# EAGLE design Lagopus_A_3 (EAGLE 9.6.2)
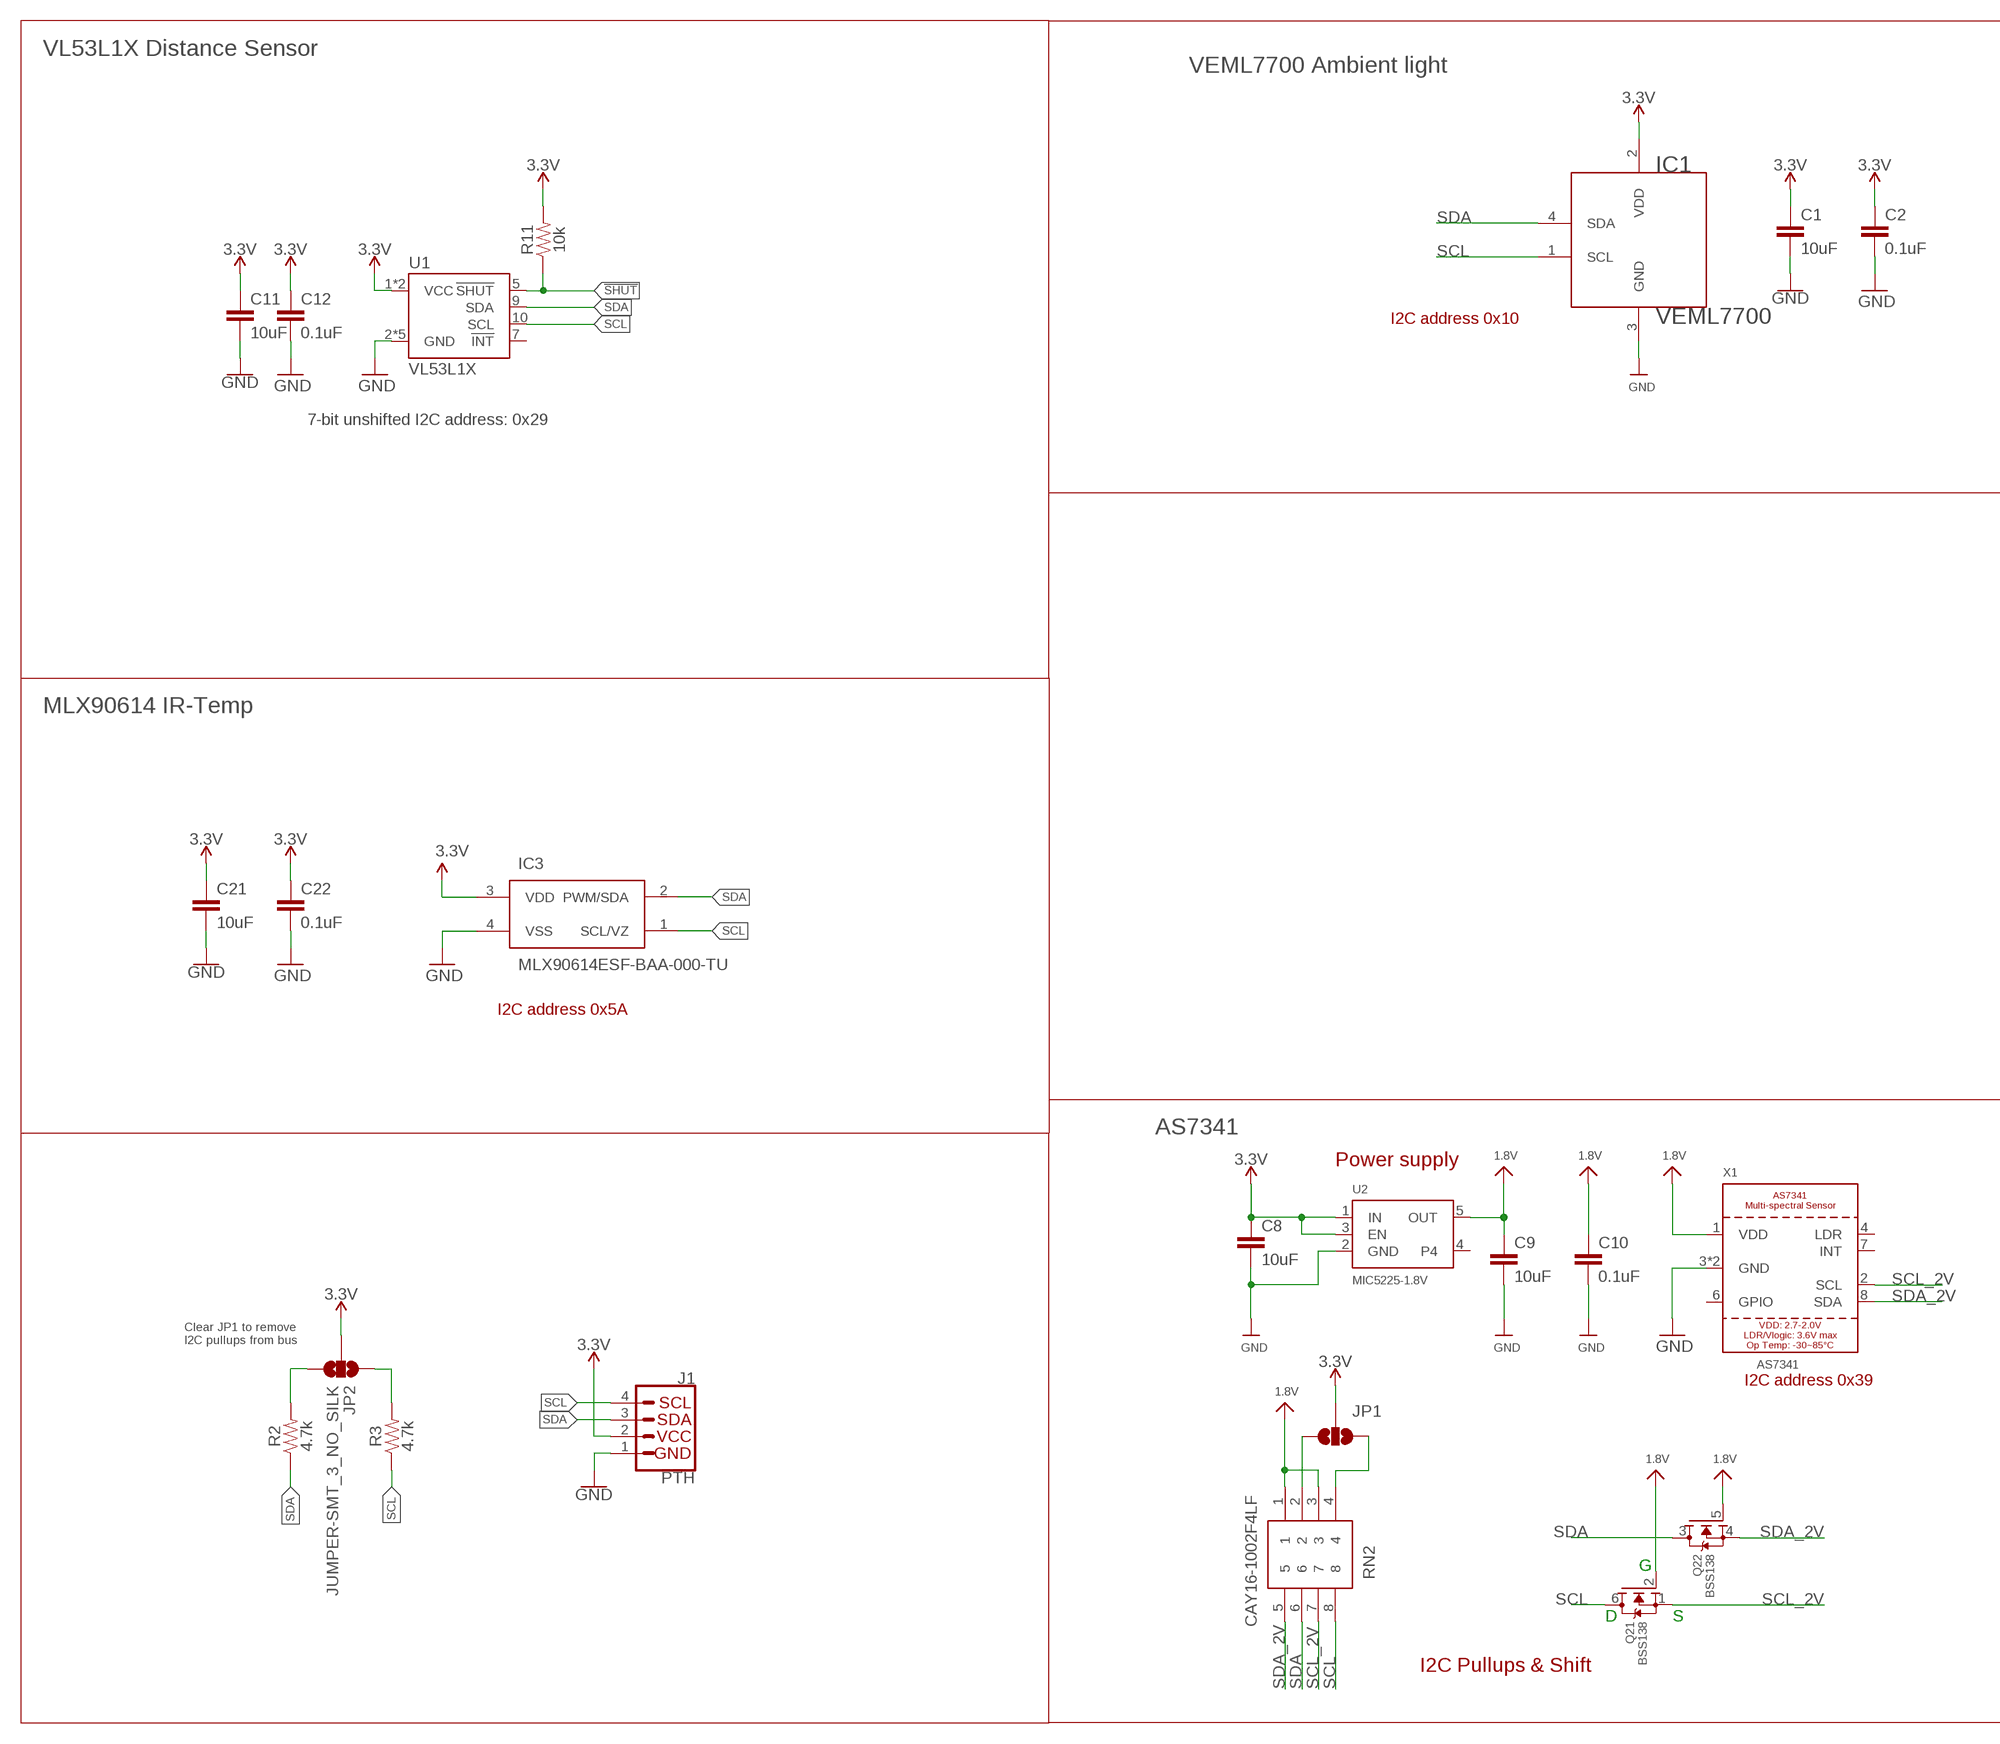
[diagram p0: schematic, sheet 1, part 1 of 2]
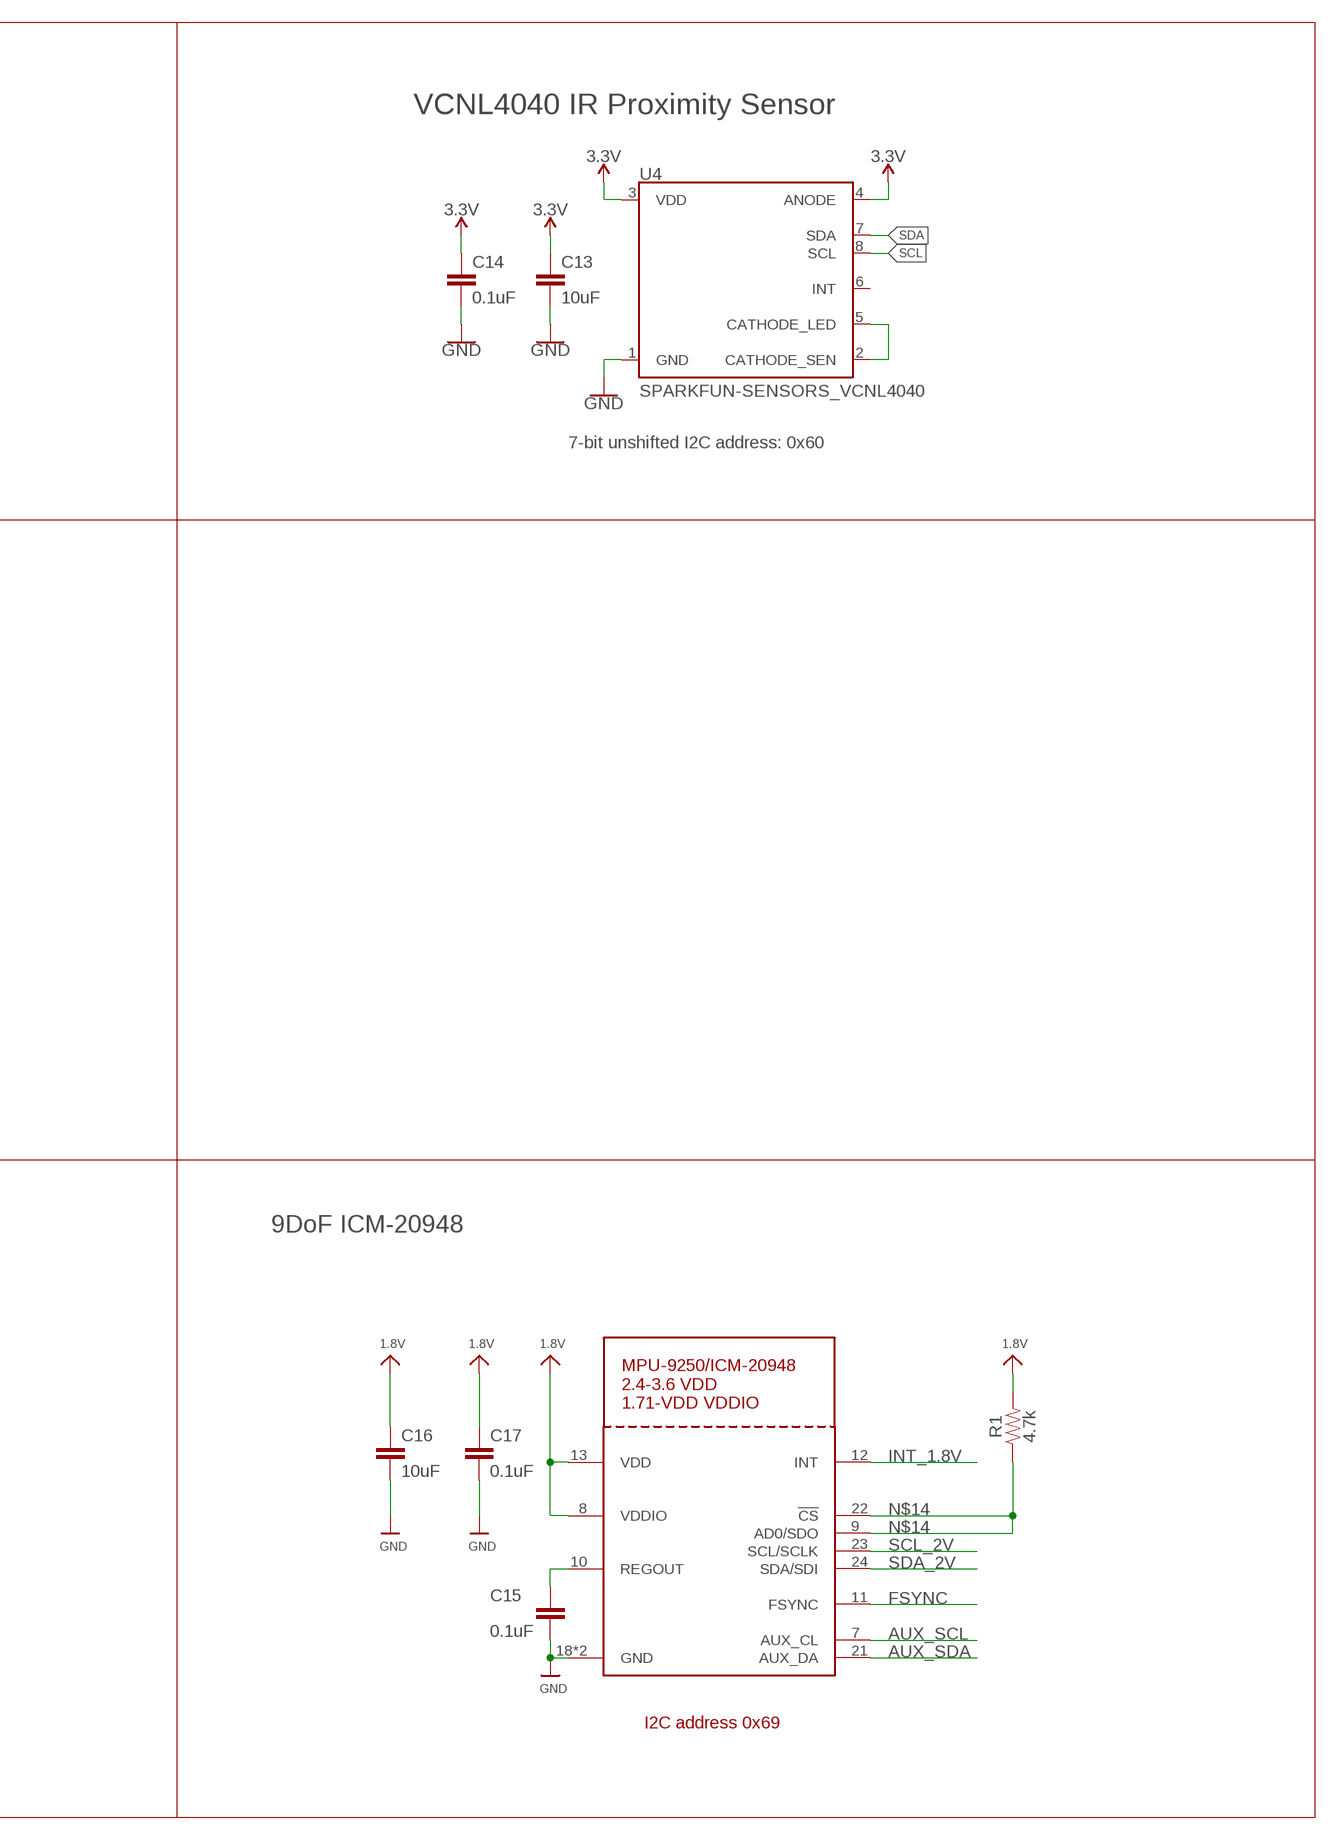
[diagram p1: schematic, sheet 1, part 2 of 2]

## Parts
C1  10uF  10UF-0603-6.3V-20%  [0603]
C2  0.1uF  0.1UF-0603-25V-(+80/-20%)  [0603]
C8  10uF  10UF-0603-6.3V-20%  [0603]
C9  10uF  10UF-0603-6.3V-20%  [0603]
C10  0.1uF  0.1UF-0603-25V-(+80/-20%)  [0603]
C11  10uF  10UF-0603-6.3V-20%  [0603]
C12  0.1uF  0.1UF-0603-25V-(+80/-20%)  [0603]
C13  10uF  10UF-0603-6.3V-20%  [0603]
C14  0.1uF  0.1UF-0603-25V-(+80/-20%)  [0603]
C15  0.1uF  0.1UF-0603-25V-(+80/-20%)  [0603]
C16  10uF  10UF-0603-6.3V-20%  [0603]
C17  0.1uF  0.1UF-0603-25V-(+80/-20%)  [0603]
C21  10uF  10UF-0603-6.3V-20%  [0603]
C22  0.1uF  0.1UF-0603-25V-(+80/-20%)  [0603]
IC1  VEML7700  [VEML7700]
IC3  MLX90614ESF-BAA-000-TU  [MLX90614ESFBAA000TU]
J1  PTH  I2C_STANDARD_NO_SILK  [1X04_NO_SILK]
JP1  JUMPER-SMT_3_NO_SILK  [SMT-JUMPER_3_NO_SILK]
JP2  JUMPER-SMT_3_NO_SILK  [SMT-JUMPER_3_NO_SILK]
Q2  BSS138  MOSFET-N_DUAL  [SOT363]
R1  4.7k  4.7KOHM-0603-1/10W-1%  [0603]
R2  4.7k  4.7KOHM-0603-1/10W-1%  [0603]
R3  4.7k  4.7KOHM-0603-1/10W-1%  [0603]
R11  10k  10KOHM-0603-1/10W-1%  [0603]
RN2  CAY16-1002F4LF  [CAY-16-F4]
U1  VL53L1X  VL53L1XSMD  [VL53L1X]
U2  MIC5225-1.8V  VREG_SOT23-5  [SOT23-5]
U4  SPARKFUN-SENSORS_VCNL4040  [SPARKFUN-SENSORS_SPARKX_VCNL4040]
U$21  MPU-9250_ICM20948  [QFN24_3MM_NOEP]
X1  AS7341  [AS7341]

## Nets
1.8V: C9.1 C10.1 C16.1 C17.1 Q2.2(1:G) Q2.5(2:G) R1.2 RN2.1 RN2.3 U2.5(OUT) U$21.8(VDDIO) U$21.13(VDD) X1.1(VDD)
3.3V: C1.1 C2.1 C8.1 C11.1 C12.1 C13.1 C14.1 C21.1 C22.1 IC1.2(VDD) IC3.3(VDD) J1.2(VCC) JP1.2 JP2.2 R11.2 U1.1(VCC) U1.11(VCC) U2.1(IN) U2.3(EN) U4.3(VDD) U4.4(ANODE)
!SHUT: R11.1 U1.5(!SHUT)
AUX_SCL: U$21.7(AUX_CL)
AUX_SDA: U$21.21(AUX_DA)
FSYNC: U$21.11(FSYNC)
GND: C1.2 C2.2 C8.2 C9.2 C10.2 C11.2 C12.2 C13.2 C14.2 C15.2 C16.2 C17.2 C21.2 C22.2 IC1.3(GND) IC3.4(VSS) J1.1(GND) U1.2(GND) U1.3(GND) U1.4(GND) U1.6(GND) U1.12(GND) U2.2(GND) U4.1(GND) U$21.18(GND) U$21.20(GND) X1.3(GND) X1.5(GND)
INT_1.8V: U$21.12(INT)
N$1: JP1.1 RN2.2
N$2: JP1.3 RN2.4
N$7: JP2.3 R2.2
N$8: JP2.1 R3.2
N$12: U4.2(CATHODE_SEN) U4.5(CATHODE_LED)
N$13: C15.1 U$21.10(REGOUT)
N$14: R1.1 U$21.9(AD0/SDO) U$21.22(!CS)
SCL: IC1.1(SCL) IC3.1(SCL/VZ) J1.4(SCL) Q2.6(1:D) R3.1 RN2.8 U1.10(SCL) U4.8(SCL)
SCL_2V: Q2.1(1:S) RN2.7 U$21.23(SCL/SCLK) X1.2(SCL)
SDA: IC1.4(SDA) IC3.2(PWM/SDA) J1.3(SDA) Q2.3(2:D) R2.1 RN2.6 U1.9(SDA) U4.7(SDA)
SDA_2V: Q2.4(2:S) RN2.5 U$21.24(SDA/SDI) X1.8(SDA)
Unconnected: U1.7(!INT) U2.4 U4.6(INT) X1.4(LDR) X1.7(INT)

## Notes on the sheet
- VL53L1X Distance Sensor
- VEML7700 Ambient light
- VCNL4040 IR Proximity Sensor
- I2C address 0x10
- 7-bit unshifted I2C address: 0x29 | 7-bit unshifted I2C address: 0x60
- MLX90614 IR-Temp
- I2C address 0x5A
- AS7341
- Power supply | 9DoF ICM-20948
- Clear JP1 to remove
  I2C pullups from bus
- I2C address 0x39
- G
- D | S
- I2C address 0x69
- I2C Pullups & Shift

## Power pins joined to a net without a drawn wire
GPIO: X1.6(GPIO)

## Library data of the parts
C1 C8 C9 C11 C13 C16 C21 = SparkFun-Capacitors:10UF: 10.0µF ceramic capacitors A capacitor is a passive two-terminal electrical component used to store electrical energy temporarily in an electric field.; PROD_ID: CAP-11015
C2 C10 C12 C14 C15 C17 C22 = SparkFun-Capacitors:0.1UF: 0.1µF ceramic capacitors A capacitor is a passive two-terminal electrical component used to store electrical energy temporarily in an electric field.; PROD_ID: CAP-00810
IC1 = VEML7700:VEML7700
IC3 = MLX90614ESF-BAA-000-TU:MLX90614ESF-BAA-000-TU: Board Mount Temperature Sensors Digital, plug & play, infrared thermometer in a TO-can Source: Datasheet <http://uk.rs-online.com/web/p/products/1942939>; DESCRIPTION: Board Mount Temperature Sensors Digital, plug & play, infrared thermometer in a TO-can; HEIGHT: 4.25mm; MANUFACTURER_NAME: Melexis; MANUFACTURER_PART_NUMBER: MLX90614ESF-BAA-000-TU; RS_PART_NUMBER: 1942939; RS_PRICE-STOCK: http://uk.rs-online.com/web/p/products/1942939
J1 = SparkX:I2C_STANDARD: SparkFun I2C Standard Pinout Header SparkFun has standardized on a pinout for all I2C based sensor breakouts. This pinout allows I2C boards to be plugged directly into the headers on Arduino Uno compatible boards, and to be daisy chained easily. Example SparkFun Products: SparkFun Atmospheric Sensor Breakout - BME280 <https://www.sparkfun.com/products/13676> SparkFun Altitude/Pressure Sensor Breakout - MPL3115A2 <https://www.sparkfun.com/products/11084> SparkFun TOF Range Finder Sensor - VL6180 <https://www.sparkfun.com/products/12785>
JP1 JP2 = SparkFun-Jumpers:JUMPER-SMT_3_NO: Normally open jumper This jumper has three pads in close proximity to each other. Apply solder to close the connection(s).
Q2 = microbuilder:MOSFET-N_DUAL: Dual N-Channel MOSFET SOT363 (2.0x1.25mm) 2N7002PS - 60V, 320mA [Digikey: 568-5984-1-ND]
R1-R3 = SparkFun-Resistors:4.7KOHM: 4.7kΩ resistor A resistor is a passive two-terminal electrical component that implements electrical resistance as a circuit element. Resistors act to reduce current flow, and, at the same time, act to lower voltage levels within circuits. - Wikipedia; PROD_ID: RES-07857
R11 = SparkFun-Resistors:10KOHM: 10kΩ resistor A resistor is a passive two-terminal electrical component that implements electrical resistance as a circuit element. Resistors act to reduce current flow, and, at the same time, act to lower voltage levels within circuits. - Wikipedia; PROD_ID: RES-00824
RN2 = CAY16-1002F4LF:CAY16-1002F4LF: Resistor Arrays 10K 1% Convex 4 resist. Bourns CAY16 Series 10k +/-1% Isolated SMT Resistor Array, 4 Resistors, 0.25W total 1206 Package Convex Source: Datasheet <http://uk.rs-online.com/web/p/products/7408767P>; ALLIED_NUMBER: 70276325; DESCRIPTION: Resistor Arrays 10K 1% Convex 4 resist. Bourns CAY16 Series 10k +/-1% Isolated SMT Resistor Array, 4 Resistors, 0.25W total 1206 Package Convex; HEIGHT: mm; MANUFACTURER_NAME: Bourns; MANUFACTURER_PART_NUMBER: CAY16-1002F4LF; RS_PART_NUMBER: 7408767P; RS_PRICE-STOCK: http://uk.rs-online.com/web/p/products/7408767P
U1 = SparkFun-Sensors:VL53L1X: STMicroelectronics VL53L1X - 400 cm IR Laser ToF Sensor VL53L1X is a state-of-the-art ToF laser-ranging sensor, enhancing the ST FlightSense product family. It is the fastest miniature ToF sensor currently on the market with accurate ranging up to 4 m and fast ranging frequency (up to 50 Hz). Housed in a miniature and reflowable package, it integrates a single photon avalanche diode (SPAD) receiving array, a 940 nm invisible laser Class 1 emitter, physical infrared filters, and optics to achieve the best ranging performance in various ambient lighting conditions with a range of cover window options.; PROD_ID: IC-13960
U2 = microbuilder:VREG_SOT23-5: SOT23-5 Fixed Voltage Regulators Part Current Out V Out V In V Dropout θJA (°C/W) TJ (°C) Digikey Part No. ADP121 150mA 3.3V 3.4-5.5V 0.09V @ 150mA -- -- ADP121-AUJZ33R7CT-ND ADP121 150mA 3.0V 3.1-5.5V 0.09V @ 150mA -- -- ADP121-AUJZ30R7CT-ND ADP122 300mA 3.3V 3.4-5.5V 0.085V @ 300mA -- -- ADP122AUJZ-3.3-R7CT-ND ADP1712 300mA 3.3V 3.5-5.5V 0.17V @ 300mA -- -- ADP1712AUJZ-3.3-R7TR-ND AP7311 (Low Cost) 150mA 3.3V 3.5-6V 0.15V @ 150mA -- -- AP7311-33WG-7DICT-ND LD39015M18R 150mA 1.8V 1.9V-5.5V 0.08V @ 100mA -- -- 497-6977-1-ND LP2985A-33DBVR 150mA 3.3V 3.3-16V 0.28V @ 150mA 206 150 296-18479-1-ND MCP1824T-3302E/OT 300mA 3.3V 3.5V-6V 0.2V @ 300mA -- -- MCP1824T-3302E/OTCT-ND MIC5205-2.5YM5 TR 150mA 2.5V 2.7-16V 0.165V @ 150mA -- -- 576-1257-2-ND MIC5205-3.0YM5 TR 150mA 3.0V 3.2V-16V 0.165V @ 150mA -- -- 576-1258-2-ND MIC5205-3.3YM5 TR 150mA 3.3V 3.5V-16V 0.165V @ 150mA -- -- 576-1259-2-ND TPS780330220 150mA 3.3V+2.2V 3.6-5.5V 250mV Max -- -- 296-23332-1-ND TDA3663/N1,135 100mA 3.3V 3.5-45V 0.18V @ 50mA -- -- 568-5343-1-ND Max operating temp can be calculated using θJA, TJ (max junction temperature), and power in watts. Set the "Maximum Ambient Temperature" until it reaches TJ ("Max Junction Temperature"), which is the absolute limit for safe use of the regulator: Heat Sink Temperature Calculator <http://www.daycounter.com/Calculators/Heat-Sink-Temperature-Calculator.phtml> For example, With 12V source into a 3.3V LP2985 and a 30mA load, we are dissipating (12V-3.3V) * 0.03A = 0.261W. With a θJA of 206 °C/W, a TJ of 150°C, and 261mW we can safely use the chip without a heat sink up to 75°C (=147.1°C Junction Temperature).
U4 = Lagopus_A_3:SPARKFUN-SENSORS_VCNL4040: Vishay VCNL4040 Human Presence sensor A presence sensor with a range of 20 cm. VCNL4040 integrates a proximity sensor (PS), ambient light sensor (ALS), and a high power IRED into one small package.; PROD_ID: IC-14227
U$21 = adafruit_sensor:MPU-9250: MPU-9250 3-Axis gyroscope and 3-Axis accelerometer
X1 = adafruit_sensor:AS7341

## Net classes
1 highpower: width 0.305 mm, drill 0.483 mm
2 lowpower: width 0.254 mm, drill 0.483 mm

## Board
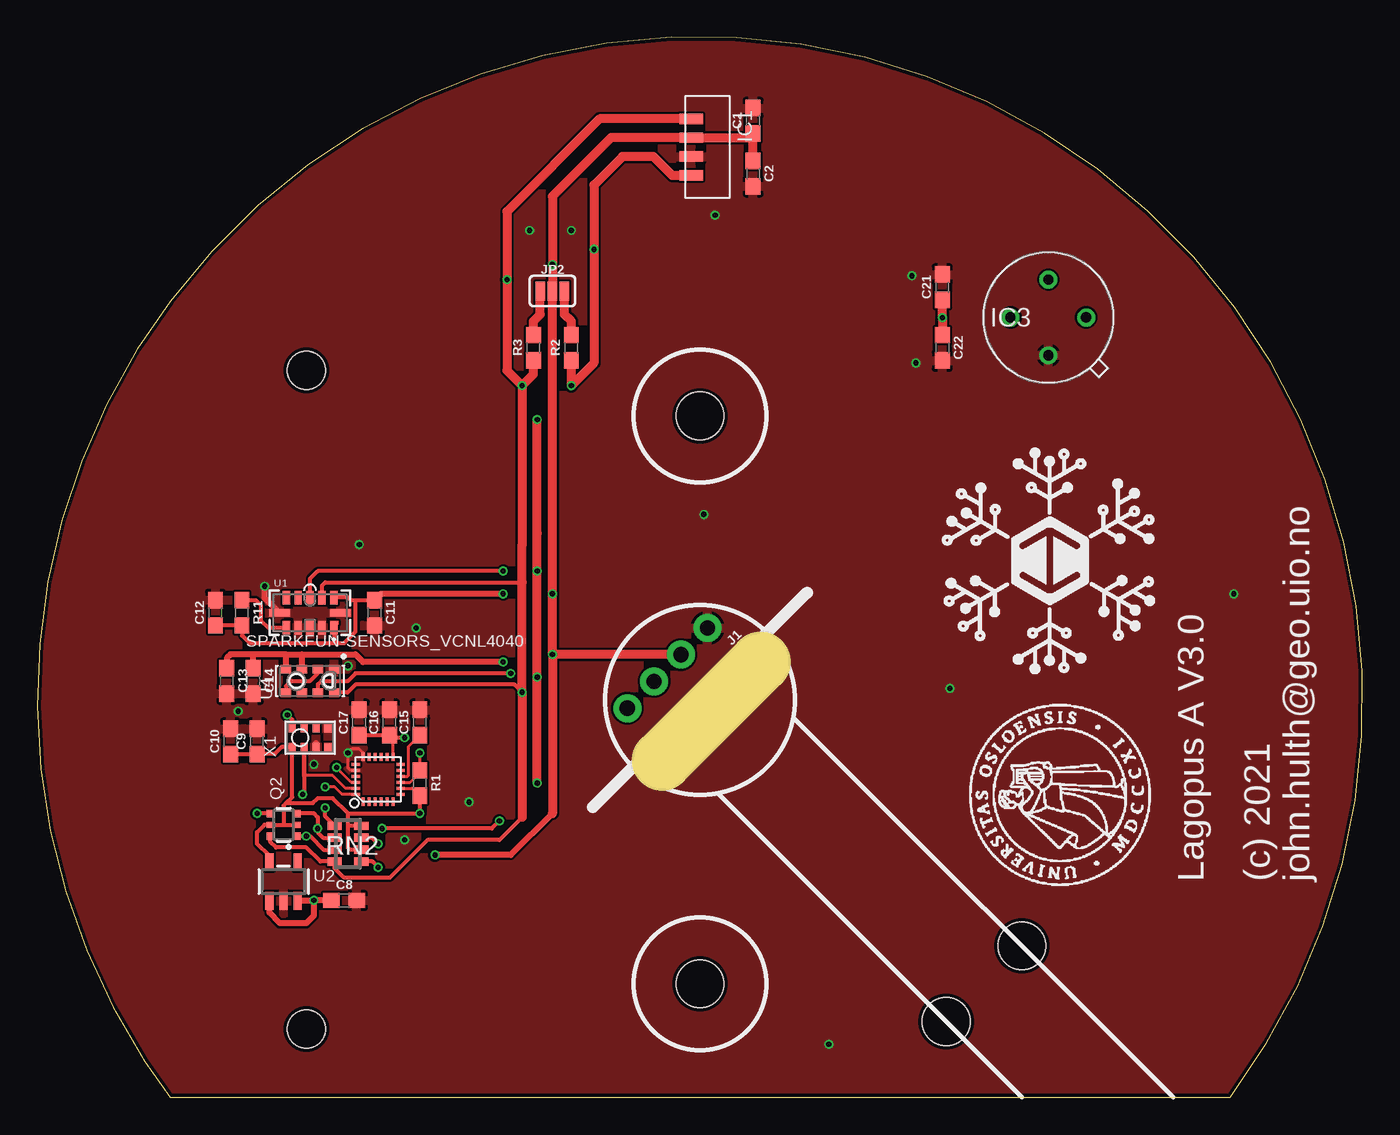
[diagram p2: board, top side]
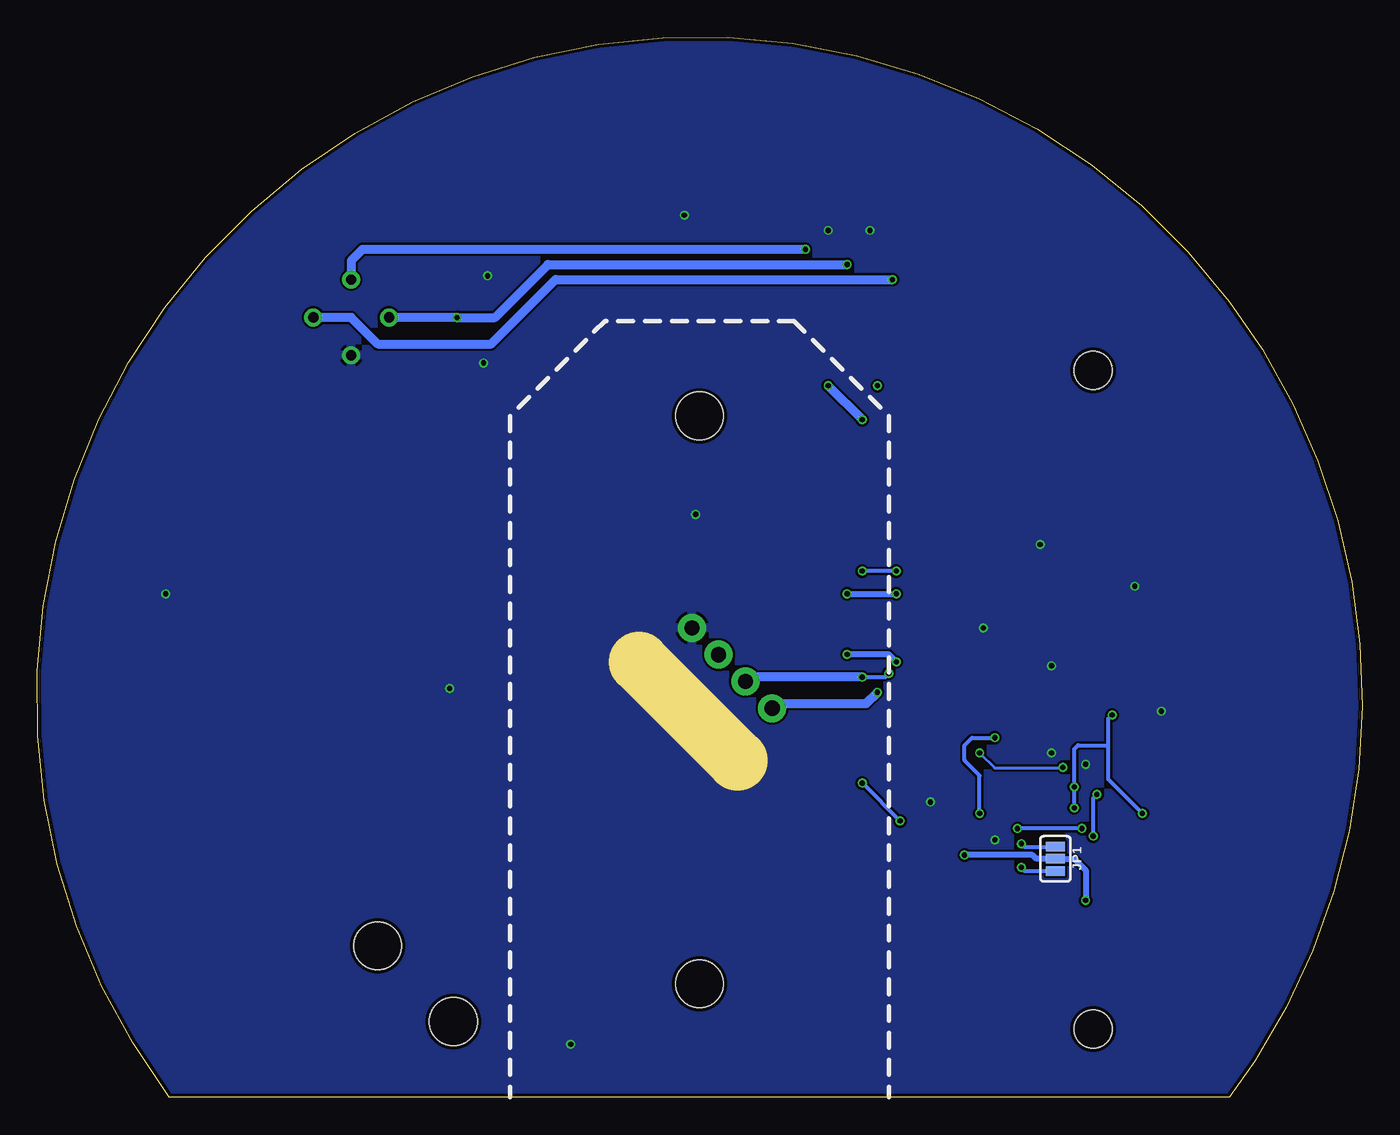
[diagram p3: board, bottom side, seen from below]

Size 88.89 x 71.13 mm. Coordinates in mm from the lower left corner, seen from the top.
Outline: 7.21,2.42 8.91,0 80.03,0 arc180 8.91,53.4 6.71,50.2 arc65 7.21,2.42
Copper layers (1*16): Top 0.018mm / dielectric 1.55mm / Bottom 0.018mm
Design rules "eC_2Layer_PClass6_BaseCopperO18_eCDefault": minimum track width 0.15mm, minimum drill 0.35mm, track to track 0.15mm, track to pad 0.15mm, pad to pad 0.15mm, via to via 0.15mm, smd to smd 0mil, copper to edge 0.25mm, drill to drill 0.35mm, minimum pad ring 0.175mm, minimum via ring 0.125mm, stop-mask expansion 0mil, vias tented up to drill 0.45mm, thermal gap 0.2mm
Holes 3.2 mm at 44.47,45.72 44.47,7.62 66.06,10.16 60.98,5.08
Holes 2.54 mm at 18.05,4.57 18.05,48.77
Milling: 1 lines

### Footprints (pad centres in the part's own frame; a part is rotated, then mirrored left to right if it is on the bottom)
0603 = smd 1.1 x 1: 1 -0.85,0; 2 0.85,0
VEML7700 = smd 0.7 x 1.6: 1 -1.905,-1.1; 2 -0.635,-1.1; 3 0.635,-1.1; 4 1.905,-1.1
MLX90614ESFBAA000TU = drill 0.69 pad 1.2: 1 -2.54,0; 2 0,-2.54; 3 2.54,0; 4 0,2.54
1X04_NO_SILK = drill 1.016 pad 1.88: 1 0,0; 2 2.54,0; 3 5.08,0; 4 7.62,0
SMT-JUMPER_3_NO_SILK = smd 0.635 x 1.27: 1 -0.813,0; 2 0,0; 3 0.813,0
SOT363 = smd 0.5 x 0.5: 1 -0.75,-0.9; 3 0.75,-0.9; 4 0.75,0.9; 6 -0.75,0.9 | smd 0.4 x 0.5: 2 0,-0.9; 5 0,0.9
CAY-16-F4 = smd 0.95 x 0.55: 1 -0.9,-1.2; 2 -0.9,-0.4; 3 -0.9,0.4; 4 -0.9,1.2; 5 0.9,-1.2; 6 0.9,-0.4; 7 0.9,0.4; 8 0.9,1.2
VL53L1X = smd 0.5 x 0.9: 1 1.6,-1; 2 0.8,-1; 3 0,-1; 4 -0.8,-1; 5 -1.6,-1; 7 -1.6,1; 8 -0.8,1; 9 0,1; 10 0.8,1; 11 1.6,1 | smd 1.4 x 0.5: 6 -2.05,0; 12 2.05,0
SOT23-5 = smd 0.55 x 1.2: 1 -0.95,-1.3; 2 0,-1.3; 3 0.95,-1.3; 4 0.95,1.3; 5 -0.95,1.3
SPARKFUN-SENSORS_SPARKX_VCNL4040 = smd 0.575 x 0.7: 1 0.787,-1.613; 2 0.787,-0.537; 3 0.787,0.537; 4 0.787,1.613; 5 -0.787,1.613; 6 -0.787,0.537; 7 -0.787,-0.537; 8 -0.787,-1.613
QFN24_3MM_NOEP = smd 0.55 x 0.2: 1 -1.5,1; 2 -1.5,0.6; 3 -1.5,0.2; 4 -1.5,-0.2; 5 -1.5,-0.6; 6 -1.5,-1; 13 1.5,-1; 14 1.5,-0.6; 15 1.5,-0.2; 16 1.5,0.2; 17 1.5,0.6; 18 1.5,1 | smd 0.2 x 0.55: 7 -1,-1.5; 8 -0.6,-1.5; 9 -0.2,-1.5; 10 0.2,-1.5; 11 0.6,-1.5; 12 1,-1.5; 19 1,1.5; 20 0.6,1.5; 21 0.2,1.5; 22 -0.2,1.5; 23 -0.6,1.5; 24 -1,1.5
AS7341 = smd 0.575 x 0.488: 1 -0.635,1.2; 2 -0.635,0.4; 3 -0.635,-0.4; 4 -0.635,-1.2; 5 0.635,-1.2; 6 0.635,-0.4; 7 0.635,0.4; 8 0.635,1.2

### Placement (x,y rotation side)
C1  48.02,65.53 90 top
C2  48.02,61.98 270 top
C8  20.59,13.21 0 top
C9  14.75,23.88 90 top
C10  12.97,23.88 90 top
C11  22.62,32.51 270 top
C12  11.95,32.51 90 top
C13  12.72,27.94 270 top
C14  14.49,27.94 270 top
C15  25.67,25.15 90 top
C16  23.64,25.15 90 top
C17  21.61,25.15 90 top
C21  60.72,54.36 90 top
C22  60.72,50.29 270 top
IC1  44.97,63.75 270 top
IC3  67.83,52.32 180 top
J1  44.97,31.5 225 top
JP1  20.59,16 270 bottom
JP2  34.56,54.1 0 top
Q2  16.53,18.29 90 top
R1  25.67,21.08 270 top
R2  35.83,50.29 90 top
R3  33.29,50.29 90 top
R11  13.73,32.51 270 top
RN2  20.84,17.02 180 top
U1  18.3,32.51 0 top
U2  16.53,14.48 0 top
U4  18.3,27.94 90 top
U$2  [HIVE-LOGO]  67.91,36.03 90 top
U$5  [UIO-LOGO-BL]  74.95,13.97 90 top
U$21  22.88,21.34 90 top
X1  18.3,24.13 90 top

### Tracks (layer width: path | path; a pad name or v marks a point on that pad's centre or on a via)
1.8V  (via drill 0.35)
  Top 0.203: U$21.13 23.88,24.06 23.72,24.21 C16.1 | U$21.8 25.17,20.74 R1.2
  Top 0.254: 16.53,18.29 Q2.5 15.26,18.29 14.75,17.78 14.75,17.02 15.58,16.19 U2.5 | 16.53,18.29 Q2.2 | 16.53,18.29 16.53,19.56 16.71,19.74 | 16.71,19.74 18.49,19.74 18.81,20.07 19.83,20.07 20.84,19.05 | 16.71,19.74 17.1,20.14 X1.1 16.4,23.5 15.93,23.03 C9.1 C10.1 | RN2.3 20.99,16.62 20.84,16.76 20.84,18.29 | 20.84,18.29 20.84,19.05 | RN2.1 20.91,18.22 20.84,18.29 | C16.1 C17.1 | v24.65,24.13 23.8,24.13 23.72,24.21 | 20.84,19.05 v25.67,19.05 R1.2
  Bottom 0.254: v25.67,19.05 25.67,21.59 26.69,22.61 26.69,23.62 26.18,24.13 v24.65,24.13
3.3V  (via drill 0.35)
  Top 0.254: 21.35,33.36 21.01,33.36 20.84,33.53 19.9,33.53 U1.11 | 21.35,33.36 C11.1 | 21.35,33.36 21.35,31.24 20.59,30.48 20.08,30.48 | 13.8,31.93 R11.2 | R11.2 C12.1 | R11.2 13.73,30.99 14.24,30.48 20.08,30.48 | U1.1 19.9,30.66 20.08,30.48
  Top 0.406: U4.3 17.77,29.72 | U4.4 16.69,29.72 | v26.69,16.26 31.77,16.26 34.56,19.05 | 17.77,29.72 21.35,29.72 21.86,29.21 v31.26,29.21 | 34.58,29.7 v34.56,29.72 | C8.1 v18.56,13.21 | v18.56,13.21 18.56,12.19 18.05,11.68 16.27,11.68 15.58,12.38 U2.1 | v18.56,13.21 18.53,13.18 U2.3 | v31.26,33.78 23.04,33.78 C11.1 | 16.69,29.72 17.77,29.72 | C13.1 12.72,29.46 12.97,29.72 14.49,29.72 | 16.69,29.72 14.49,29.72 | C14.1 14.49,29.72
  Top 0.61: J1.2 34.58,29.7 | 34.56,19.05 v34.56,29.72 v34.56,33.78 34.56,38.61 JP2.2 v34.56,55.88 34.56,60.45 38.5,64.39 IC1.2 47.73,64.39 C1.1 C2.1 | C21.1 v60.72,52.32 C22.1
  Bottom 0.406: v26.69,16.26 22.11,16.26 21.86,16 JP1.2 19.32,16 18.56,15.24 v18.56,13.21 | v34.56,33.78 v31.26,33.78 | v34.56,29.72 31.77,29.72 v31.26,29.21
  Bottom 0.61: v34.56,55.88 54.63,55.88 58.18,52.32 v60.72,52.32 IC3.3
!SHUT
  Top 0.254: R11.1 14.66,33.36 15,33.02 15,32 15.49,31.51 U1.5
GND  (via drill 0.35)
  Top 0.203: U$21.18 21.88,23.11 21.86,23.11 21.61,23.37 21.1,23.37 v20.84,23.11 20.84,22.1 21.01,21.94 U$21.20
  Top 0.254: 19.5,24.82 X1.5
  Top 0.406: X1.3 18.7,23.76 | U1.6 15.26,33.51 v15.26,34.29
  other vias: 20.84,28.96 25.42,31.5 18.56,22.35 21.61,37.08 28.97,19.81 13.48,25.91 80.28,33.78 44.72,39.12 53.1,3.56 61.23,27.43 24.65,17.27 33.04,58.17 35.83,58.17 58.69,55.12 58.94,49.28 45.48,59.18
  pour Bottom: 0.02,0 0.02,71.12 89.93,71.12 89.93,0
  pour Top: 0.02,72.14 0.02,0 89.42,0 89.42,72.14
N$1  (via drill 0.35)
  Top 0.254: v22.88,17.02 22.48,17.42 RN2.2
  Bottom 0.254: v22.88,17.02 22.67,16.82 JP1.1
N$2  (via drill 0.35)
  Top 0.254: RN2.4 22.48,15.82 v22.88,15.43
  Bottom 0.254: v22.88,15.43 22.64,15.19 JP1.3
N$7
  Top 0.61: R2.2 35.83,52.07 35.37,52.53 JP2.3
N$8
  Top 0.61: R3.2 33.29,52.07 33.75,52.53 JP2.1
N$12
  Top 0.254: U4.5 16.69,27.6 17.03,27.94 18.3,27.94 18.84,28.48 U4.2
N$13
  Top 0.203: U$21.10 24.85,21.54 24.91,21.59 24.91,23.53 C15.1
N$14  (via drill 0.35)
  Top 0.203: U$21.9 25.02,21.14 25.67,21.79 R1.1 v25.67,23.11 | U$21.22 21.04,21.14 20.08,22.1 v20.08,22.14
  Bottom 0.203: v25.67,23.11 24.65,22.1 20.13,22.1 v20.08,22.14
SCL  (via drill 0.35)
  Top 0.254: Q2.6 15.63,17.16 16.02,16.76 18.05,16.76 19,15.82 RN2.8 19.94,15.38 20.59,14.73 23.64,14.73 26.18,17.27 31,17.27 32.53,18.8 | U1.10 19.1,34.33 19.32,34.54 32.53,34.54 | v32.53,27.18 32.02,27.69 21.35,27.69 20.82,27.15 U4.8
  Top 0.61: 32.53,18.8 v32.53,27.18 32.53,34.54 32.53,37.08 v32.53,47.75 | v32.53,47.75 33.29,48.51 R3.1 | IC1.1 37.73,65.66 31.51,59.44 v31.51,54.86 31.51,48.77 v32.53,47.75
  Bottom 0.61: v32.53,27.18 33.29,26.42 39.28,26.42 J1.4 | v31.51,54.86 54.12,54.86 58.44,50.55 66.06,50.55 67.83,52.32 IC3.1
SCL_2V  (via drill 0.35)
  Top 0.203: U$21.23 20.68,20.74 19.83,21.59 17.9,21.59
  Top 0.254: Q2.1 v18.04,17.54 | v18.04,17.54 v18.05,17.53 | v17.8,20.32 17.9,20.43 X1.2 17.9,21.59 | v18.04,17.54 18.29,17.54 19.21,16.62 RN2.7
  Bottom 0.254: v18.05,17.53 18.05,20.07 v17.8,20.32
SDA  (via drill 0.35)
  Top 0.254: Q2.3 18.57,19.04 18.81,18.8 v18.81,18.03 18.81,17.78 19.17,17.42 RN2.6 | U4.7 18.84,27.72 19.07,27.94 20.84,27.94 21.35,28.45 v31.77,28.45 | v31,18.54 30.5,18.03 v23.13,18.03 | U1.9 18.3,34.8 18.81,35.31 v31.26,35.31
  Top 0.61: v33.54,21.08 v33.54,28.19 v33.54,35.31 33.54,37.85 v33.54,45.47 | R2.1 v35.83,47.75 37.35,49.28 v37.35,56.9 37.35,61.21 39.26,63.12 41.33,63.12 42.6,61.85 IC1.4
  Bottom 0.254: v18.81,18.03 v23.13,18.03 | v33.54,21.08 v31,18.54 | v33.54,28.19 32.02,28.19 v31.77,28.45 | v31.26,35.31 v33.54,35.31
  Bottom 0.61: v33.54,28.19 41.09,28.19 J1.3 | v35.83,47.75 v33.54,45.47 | v37.35,56.9 67.07,56.9 67.83,56.13 IC3.2
SDA_2V  (via drill 0.35)
  Top 0.203: U$21.24 20.45,20.34 19.95,20.83 v19.32,20.83
  Top 0.254: Q2.4 14.76,19.04 v14.75,19.05 | v16.78,25.65 17.1,25.33 X1.8 | RN2.5 19.32,18.84 v19.32,19.42
  Bottom 0.254: v19.32,19.42 v19.32,20.83 19.32,23.37 19.07,23.62 17.03,23.62 | v14.75,19.05 17.03,21.34 17.03,23.62 | 17.03,23.62 17.03,25.4 v16.78,25.65

### Text on the board
tPlace: Lagopus A V3.0 | (c) 2021 / john.hulth@geo.uio.no